# Altium schematic sheet Breakout Connections.SchDoc
size A; SheetNumber: 6; SheetTotal: 6
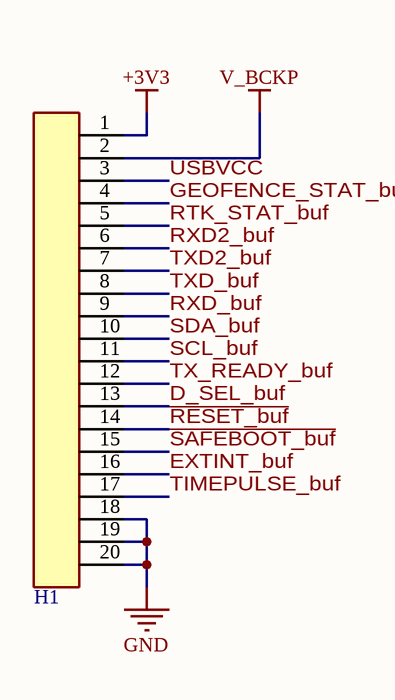
[diagram p0: Breakout Connections.SchDoc]

## Parts
H1  1x20 Header  [[Header] 1x20 Male]  (value not drawn)

## Nets
+3V3: H1.1
GND: H1.18 H1.19 H1.20
V_BCKP: H1.2
~{RESET_buf}: H1.14
~{SAFEBOOT_buf}: H1.15
D_SEL_buf: H1.13
EXTINT_buf: H1.16
GEOFENCE_STAT_buf: H1.4
RTK_STAT_buf: H1.5
RXD2_buf: H1.6
RXD_buf: H1.9
SCL_buf: H1.11
SDA_buf: H1.10
TIMEPULSE_buf: H1.17
TX_READY_buf: H1.12
TXD2_buf: H1.7
TXD_buf: H1.8
USBVCC: H1.3

## Library data of the parts
H1 = [Header] 1x20 Male: 2.54mm pitch